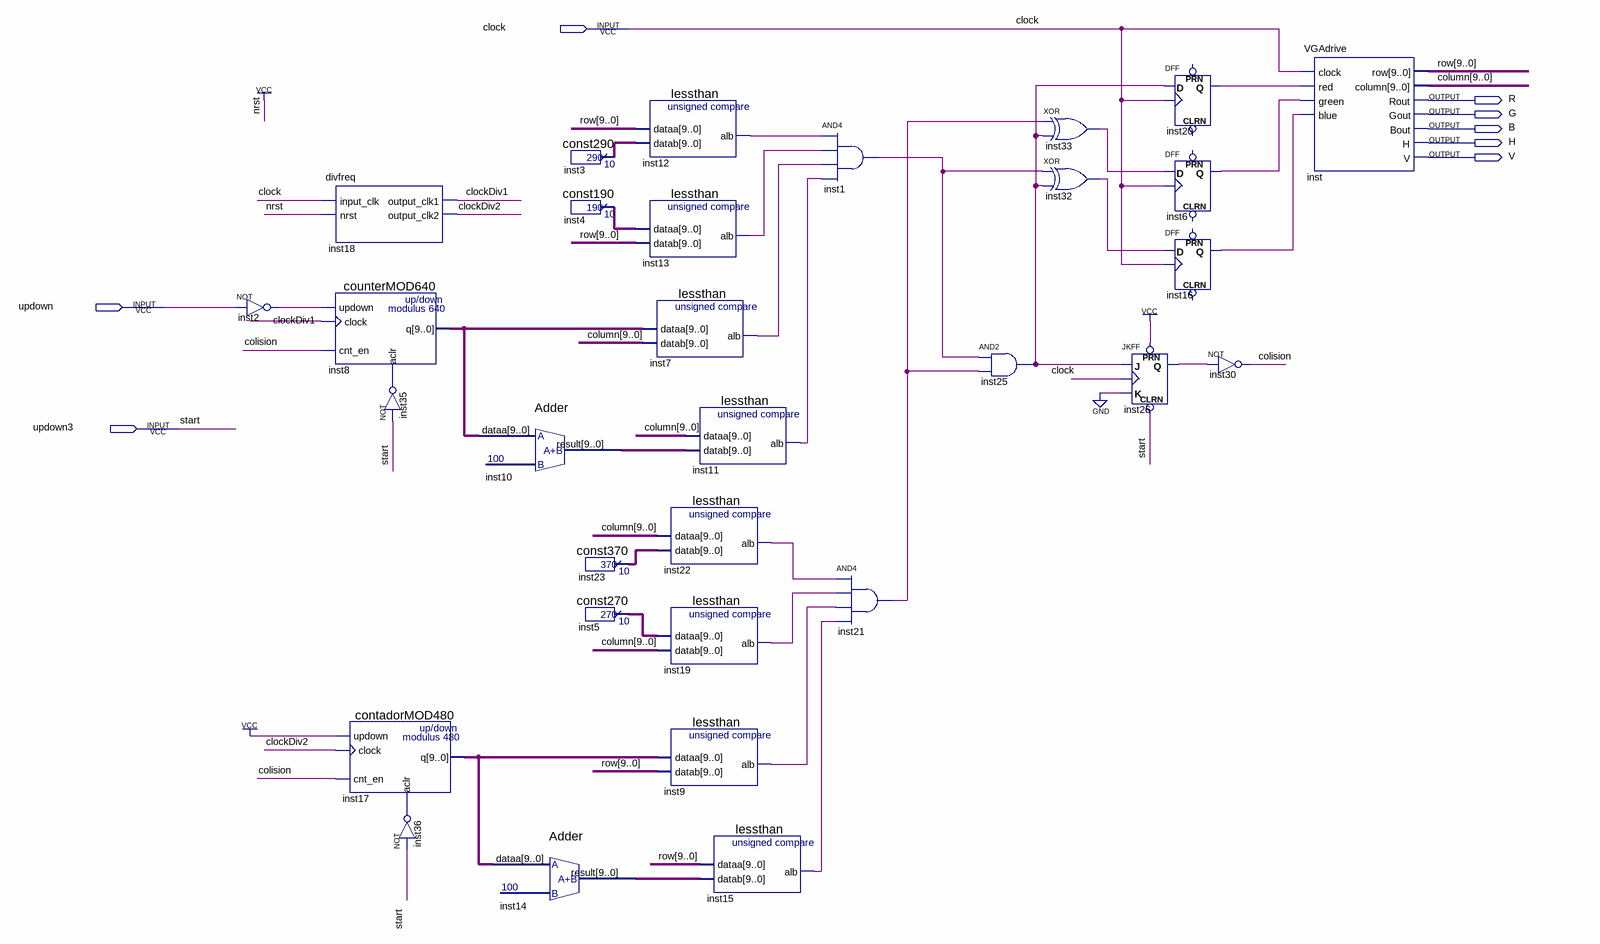
[diagram p0: schematic sheet]
// Quartus schematic vgatest.bdf as structural Verilog: 31 symbols, 8 pins
module vgatest (
  input  clock,
  input  updown,
  input  updown3,
  output R,
  output G,
  output B,
  output H,
  output V
);

  wire clockDiv1, clockDiv2, colision, inst1_out, inst2_out, inst6_q, inst7_alb, inst9_alb, inst11_alb,
       inst12_alb, inst13_alb, inst15_alb, inst16_q, inst19_alb, inst20_q, inst21_out, inst22_alb,
       inst25_out, inst26_q, inst32_out, inst33_out, inst35_out, inst36_out;
  wire [9:0] column, inst3_result, inst4_result, inst5_result, inst8_q, inst10_result, inst14_result,
       inst17_q, inst23_result, row;

  not inst2 (inst2_out, updown);
  divfreq inst18 (.input_clk(clock), .nrst(1'b1), .output_clk1(clockDiv1), .output_clk2(clockDiv2));
  counterMOD640 inst8 (.updown(inst2_out), .clock(clockDiv1), .cnt_en(colision), .aclr(inst35_out), .q(inst8_q));
  contadorMOD480 inst17 (.updown(1'b1), .clock(clockDiv2), .cnt_en(colision), .aclr(inst36_out), .q(inst17_q));
  not inst35 (inst35_out, updown3);
  not inst36 (inst36_out, updown3);
  Adder inst10 (.dataa(inst8_q), .result(inst10_result));
  Adder inst14 (.dataa(inst17_q), .result(inst14_result));
  const290 inst3 (.result(inst3_result));
  const190 inst4 (.result(inst4_result));
  const370 inst23 (.result(inst23_result));
  const270 inst5 (.result(inst5_result));
  lessthan inst12 (.dataa(row), .datab(inst3_result), .alb(inst12_alb));
  lessthan inst13 (.dataa(inst4_result), .datab(row), .alb(inst13_alb));
  lessthan inst7 (.dataa(inst8_q), .datab(column), .alb(inst7_alb));
  lessthan inst11 (.dataa(column), .datab(inst10_result), .alb(inst11_alb));
  lessthan inst22 (.dataa(column), .datab(inst23_result), .alb(inst22_alb));
  lessthan inst19 (.dataa(inst5_result), .datab(column), .alb(inst19_alb));
  lessthan inst9 (.dataa(inst17_q), .datab(row), .alb(inst9_alb));
  lessthan inst15 (.dataa(row), .datab(inst14_result), .alb(inst15_alb));
  and inst1 (inst1_out, inst12_alb, inst13_alb, inst7_alb, inst11_alb);
  and inst21 (inst21_out, inst22_alb, inst19_alb, inst9_alb, inst15_alb);
  and inst25 (inst25_out, inst1_out, inst21_out);
  xor inst33 (inst33_out, inst21_out, inst25_out);
  xor inst32 (inst32_out, inst1_out, inst25_out);
  JKFF inst26 (.PRN(1'b1), .CLRN(updown3), .K(1'b0), .J(inst25_out), .CLK(clock), .Q(inst26_q));
  DFF inst20 (.CLK(clock), .D(inst25_out), .Q(inst20_q));  // open: CLRN, PRN
  DFF inst6 (.CLK(clock), .D(inst33_out), .Q(inst6_q));  // open: CLRN, PRN
  DFF inst16 (.CLK(clock), .D(inst32_out), .Q(inst16_q));  // open: CLRN, PRN
  not inst30 (colision, inst26_q);
  VGAdrive inst (
    .clock(clock), .red(inst20_q), .green(inst6_q), .blue(inst16_q), .row(row), .column(column), .Rout(R),
    .Gout(G), .Bout(B), .H(H), .V(V));

  // Other names for the same wires on the sheet: start = updown3
endmodule
